# Altium schematic sheet CPU.SchDoc
size A4; SheetNumber: 2
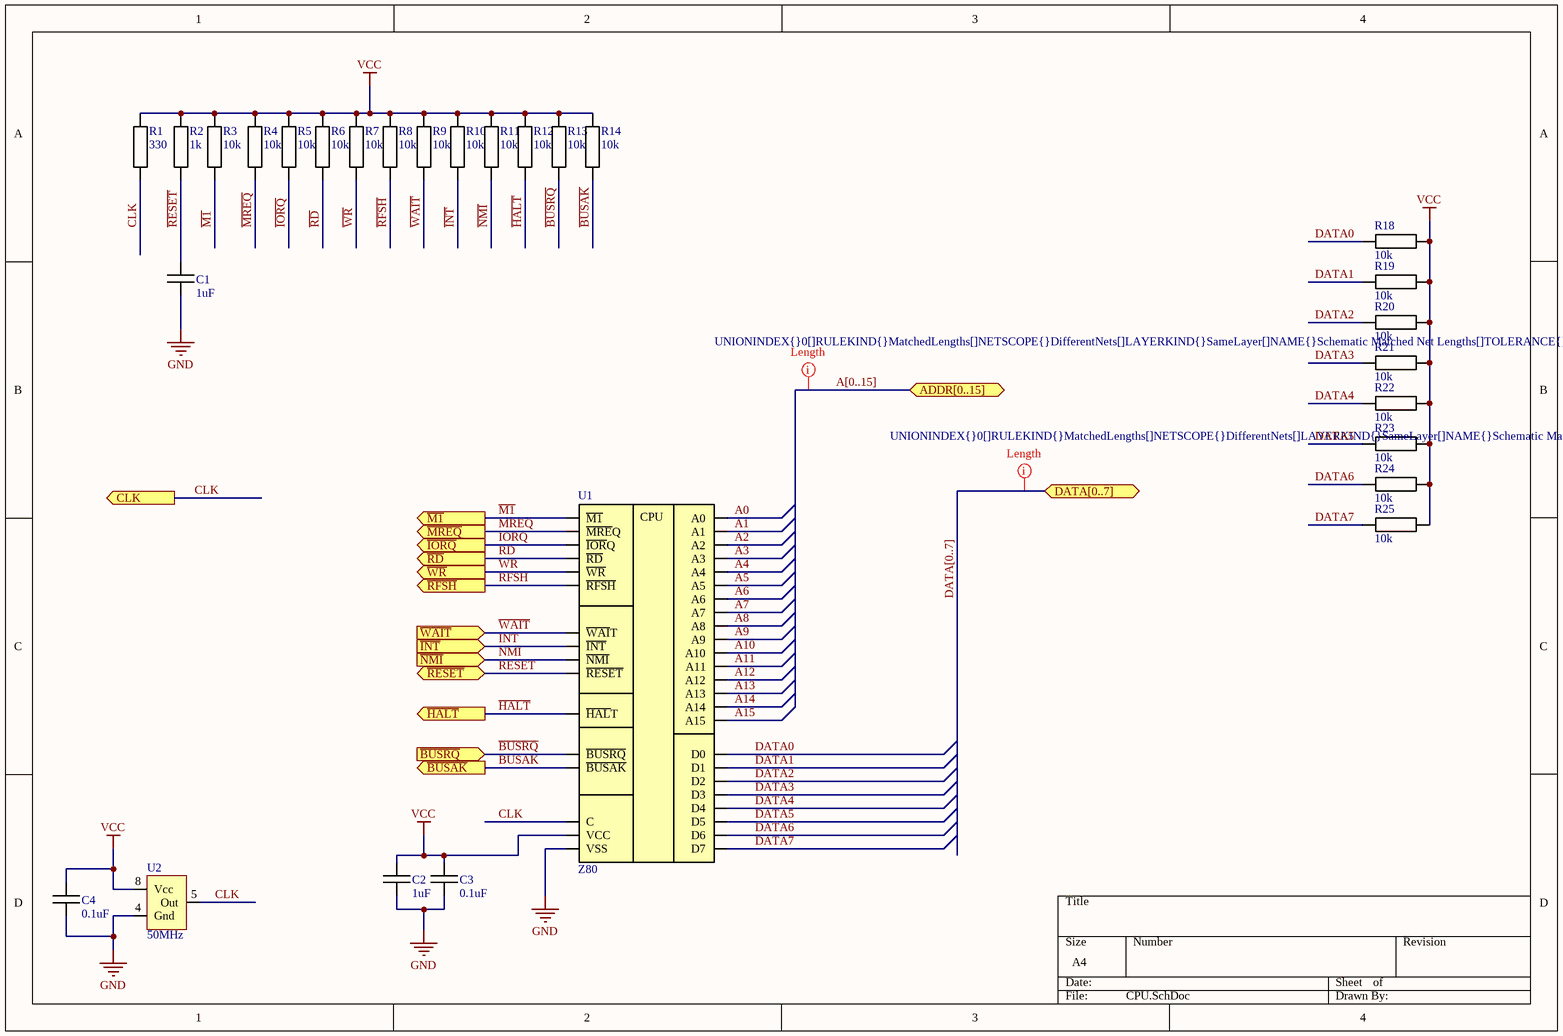
[diagram p0: CPU.SchDoc]

## Parts
C1  1uF  [SMD 0603]
C2  1uF  [SMD 0603]
C3  0.1uF  [SMD 0603]
C4  0.1uF  [SMD 0603]
R1  330  [SMD 0603]
R2  1k  [SMD 0603]
R3  10k  [SMD 0603]
R4  10k  [SMD 0603]
R5  10k  [SMD 0603]
R6  10k  [SMD 0603]
R7  10k  [SMD 0603]
R8  10k  [SMD 0603]
R9  10k  [SMD 0603]
R10  10k  [SMD 0603]
R11  10k  [SMD 0603]
R12  10k  [SMD 0603]
R13  10k  [SMD 0603]
R14  10k  [SMD 0603]
R18  10k  [SMD 0603]
R19  10k  [SMD 0603]
R20  10k  [SMD 0603]
R21  10k  [SMD 0603]
R22  10k  [SMD 0603]
R23  10k  [SMD 0603]
R24  10k  [SMD 0603]
R25  10k  [SMD 0603]
U1  Z80  [Z80]
U2  50MHz  [XTALL GEN]

## Ports
ADDR[0..15] (bidir), CLK (out), DATA[0..7] (bidir), ~{BUSAK} (out), ~{BUSRQ} (in), ~{HALT} (out), ~{INT} (in), ~{IORQ} (out), ~{M1} (out), ~{MREQ} (out), ~{NMI} (in), ~{RD} (out), ~{RESET} (bidir), ~{RFSH} (out), ~{WAIT} (in), ~{WR} (out)

## Nets
GND: C1.1 C2.1 C3.1 C4.1 U1.29(VSS) U2.4(Gnd)
VCC: C2.2 C3.2 C4.2 R1.2 R2.2 R3.2 R4.2 R5.2 R6.2 R7.2 R8.2 R9.2 R10.2 R11.2 R12.2 R13.2 R14.2 R18.2 R19.2 R20.2 R21.2 R22.2 R23.2 R24.2 R25.2 U1.11(VCC) U2.8(Vcc)
~{BUSAK}: R14.1 U1.23(~{BUSAK}) ; port ~{BUSAK}
~{BUSRQ}: R13.1 U1.25(~{BUSRQ}) ; port ~{BUSRQ}
~{HALT}: R12.1 U1.18(~{HAL}T) ; port ~{HALT}
~{INT}: R10.1 U1.16(~{INT}) ; port ~{INT}
~{IORQ}: R5.1 U1.20(~{IOR}Q) ; port ~{IORQ}
~{M1}: R3.1 U1.27(~{M1}) ; port ~{M1}
~{MREQ}: R4.1 U1.19(~{MRE}Q) ; port ~{MREQ}
~{NMI}: R11.1 U1.17(~{NMI}) ; port ~{NMI}
~{RD}: R6.1 U1.21(~{RD}) ; port ~{RD}
~{RESET}: C1.2 R2.1 U1.26(~{RESET}) ; port ~{RESET}
~{RFSH}: R8.1 U1.28(~{RFSH}) ; port ~{RFSH}
~{WAIT}: R9.1 U1.24(~{WAI}T) ; port ~{WAIT}
~{WR}: R7.1 U1.22(~{WR}) ; port ~{WR}
A0: U1.30(A0)
A1: U1.31(A1)
A2: U1.32(A2)
A3: U1.33(A3)
A4: U1.34(A4)
A5: U1.35(A5)
A6: U1.36(A6)
A7: U1.37(A7)
A8: U1.38(A8)
A9: U1.39(A9)
A10: U1.40(A10)
A11: U1.1(A11)
A12: U1.2(A12)
A13: U1.3(A13)
A14: U1.4(A14)
A15: U1.5(A15)
CLK: R1.1 U1.6(C) U2.5(Out) ; port CLK
DATA0: R18.1 U1.14(D0)
DATA1: R19.1 U1.15(D1)
DATA2: R20.1 U1.12(D2)
DATA3: R21.1 U1.8(D3)
DATA4: R22.1 U1.7(D4)
DATA5: R23.1 U1.9(D5)
DATA6: R24.1 U1.10(D6)
DATA7: R25.1 U1.13(D7)

## Buses and harness runs
bus A[0..15] = port ADDR[0..15]
bus DATA[0..7] = port DATA[0..7]

## Layout directives
rule Matched Net Lengths [Tolerance = 60mil]: (no net found under the mark)

## Notes on the sheet
- (in symbol Z80) CPU

## Library data of the parts
C1-C4 = Capasitor
  C1 C2: Value: 1uF
  C3 C4: Value: 0.1uF
R1-R14 R18-R25 = Resistor
  R1: Value: 330
  R2: Value: 1k
  R3-R14 R18-R25: Value: 10k
U1 = Z80: Zilog CPU
U2 = XTALL GEN: value: 50MHz